# EAGLE schematic Trinket_Shield (EAGLE 7.5.0)
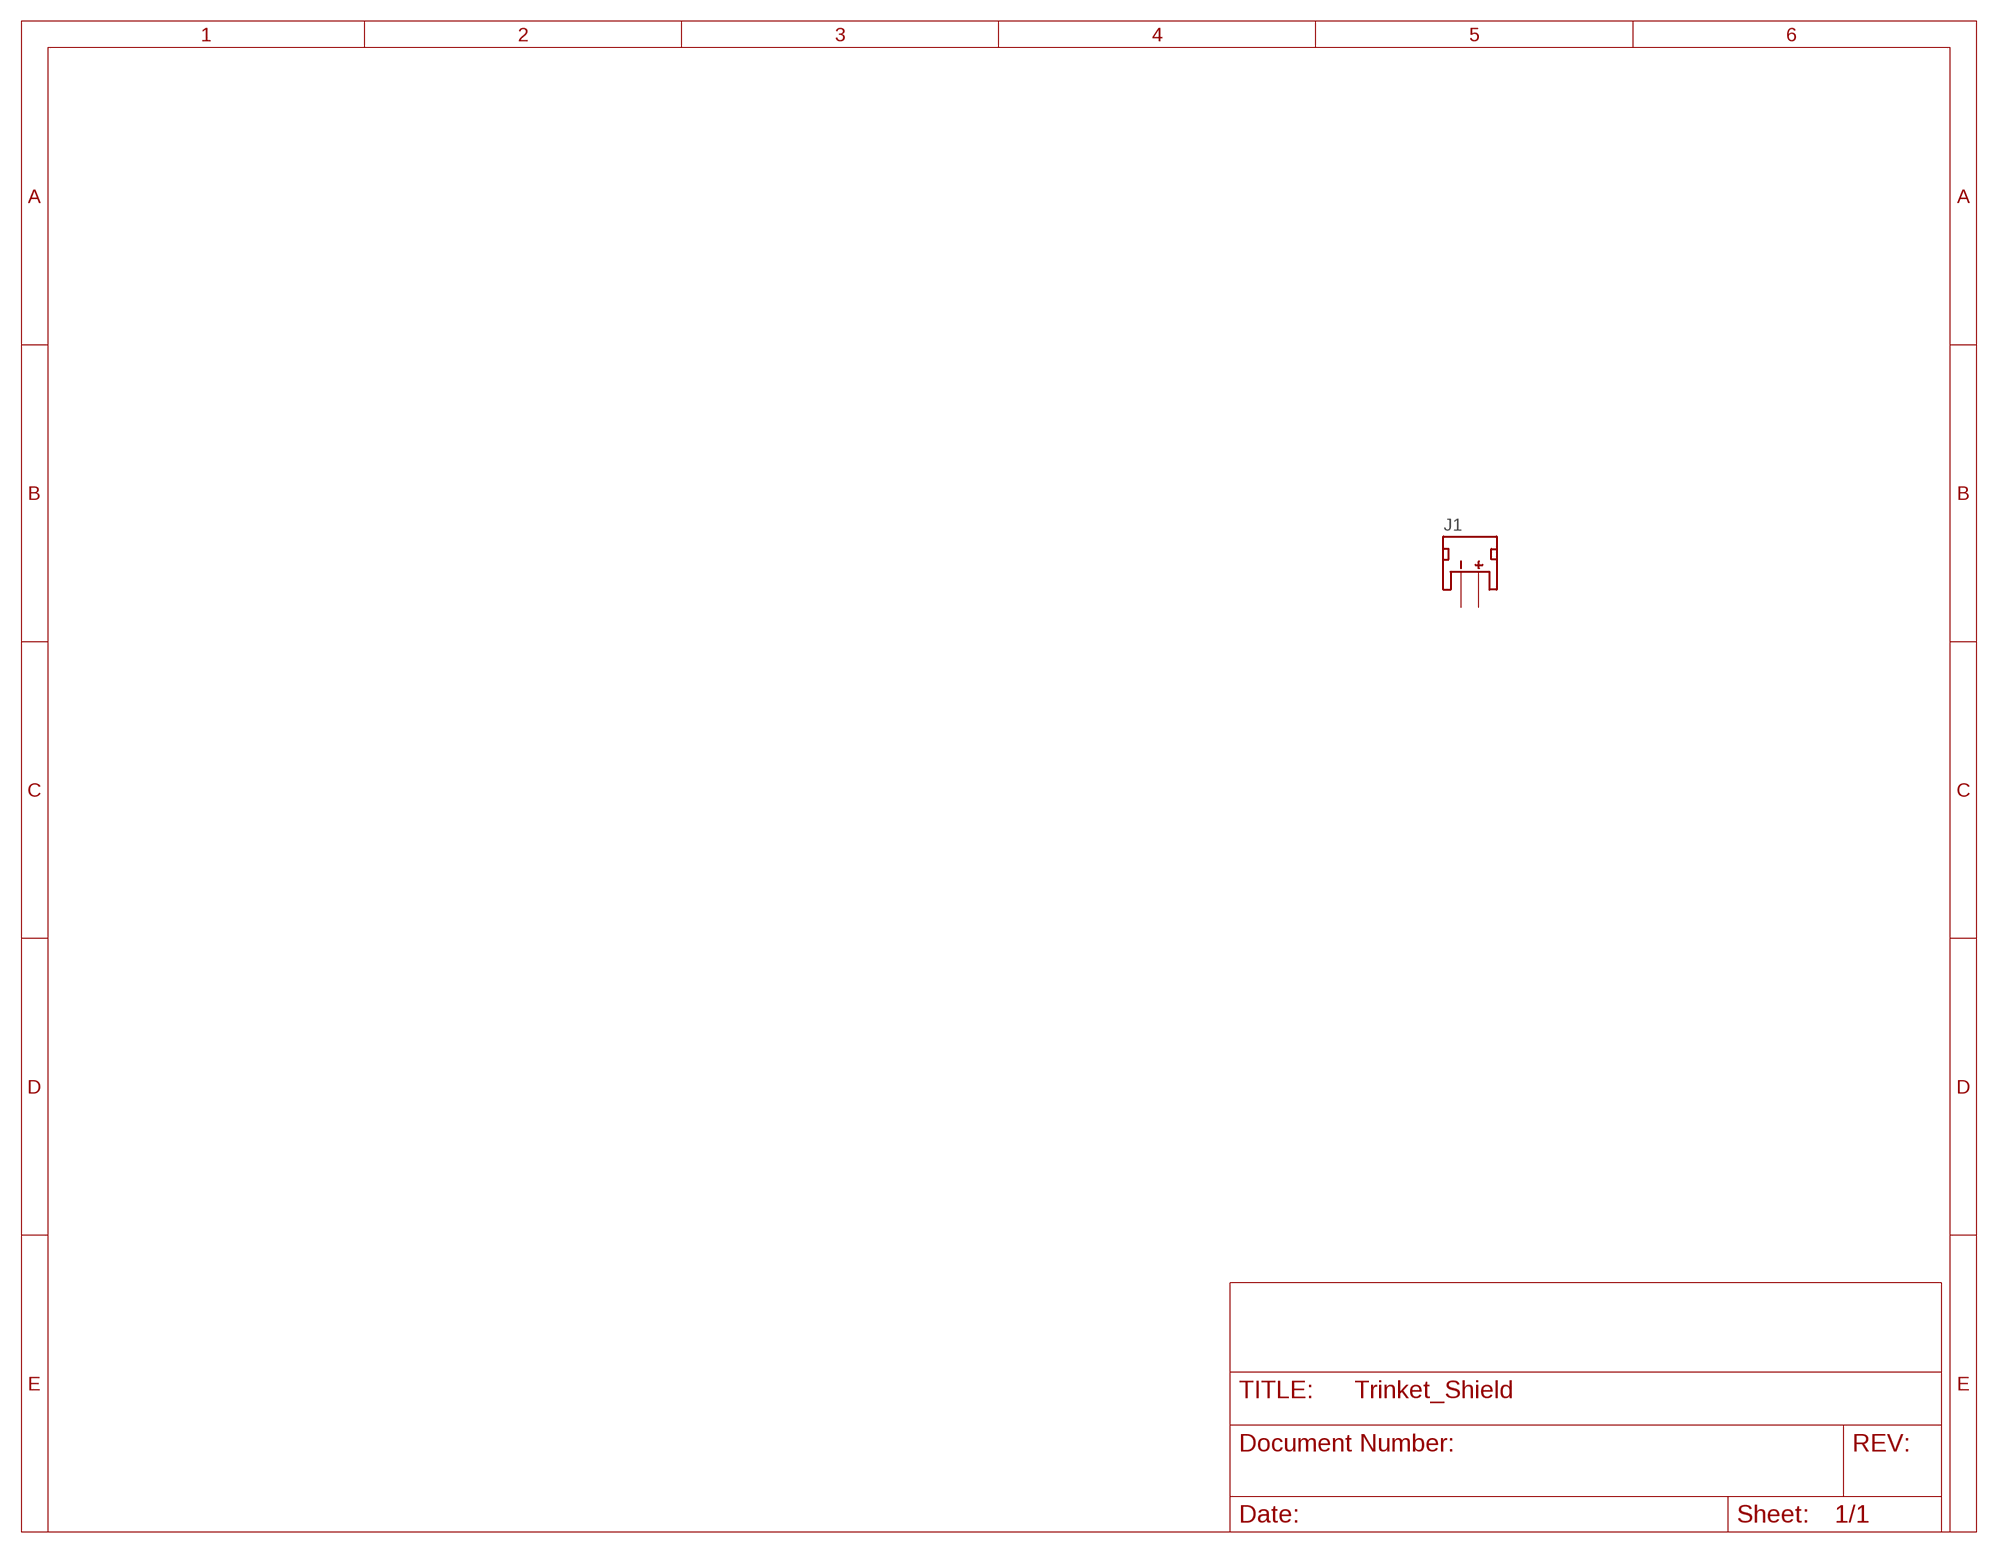
[diagram p0: schematic, sheet 1]

## Parts
J1  JST_2MM_MALE  [JST-2-SMD]
Unconnected: J1.1(-) J1.2(+) J1.NC1(PAD1) J1.NC2(PAD2)

## Library data of the parts
J1 = SparkFun-Connectors:JST_2MM_MALE: Mates to single-cell LiPo batteries. CONN-11443 Now with smashable polarity marks!; BTM_NEG: -; BTM_POS: +; PROD_ID: CONN-11443; TOP_NEG: -; TOP_POS: +